# Altium schematic sheet BackplaneConnector.SchDoc: =ProjectName
size 420 x 297 mm; Author: G.K.; CompanyName: WUT; DrawnBy: G.K. and P.K.; Organization: WUT ISE; Address1: Warsaw Univeristy of Technology; Address2: Nowowiejska 15/19; DocumentNumber: 7; Revision: 1.1; SheetNumber: 7; SheetTotal: 12; EDA_Number: ARTIQ; Projet: ARTIQ/SINARA; ModifiedBy: -; CreateDate: XX/XX/XXXX; CheckedDate: -; Title2: BackplaneConnector.SchDoc; DivGrp: ISE; Designer: G.K.; ModifiedDate: -; ProjectName: ARTIQ/SINARA
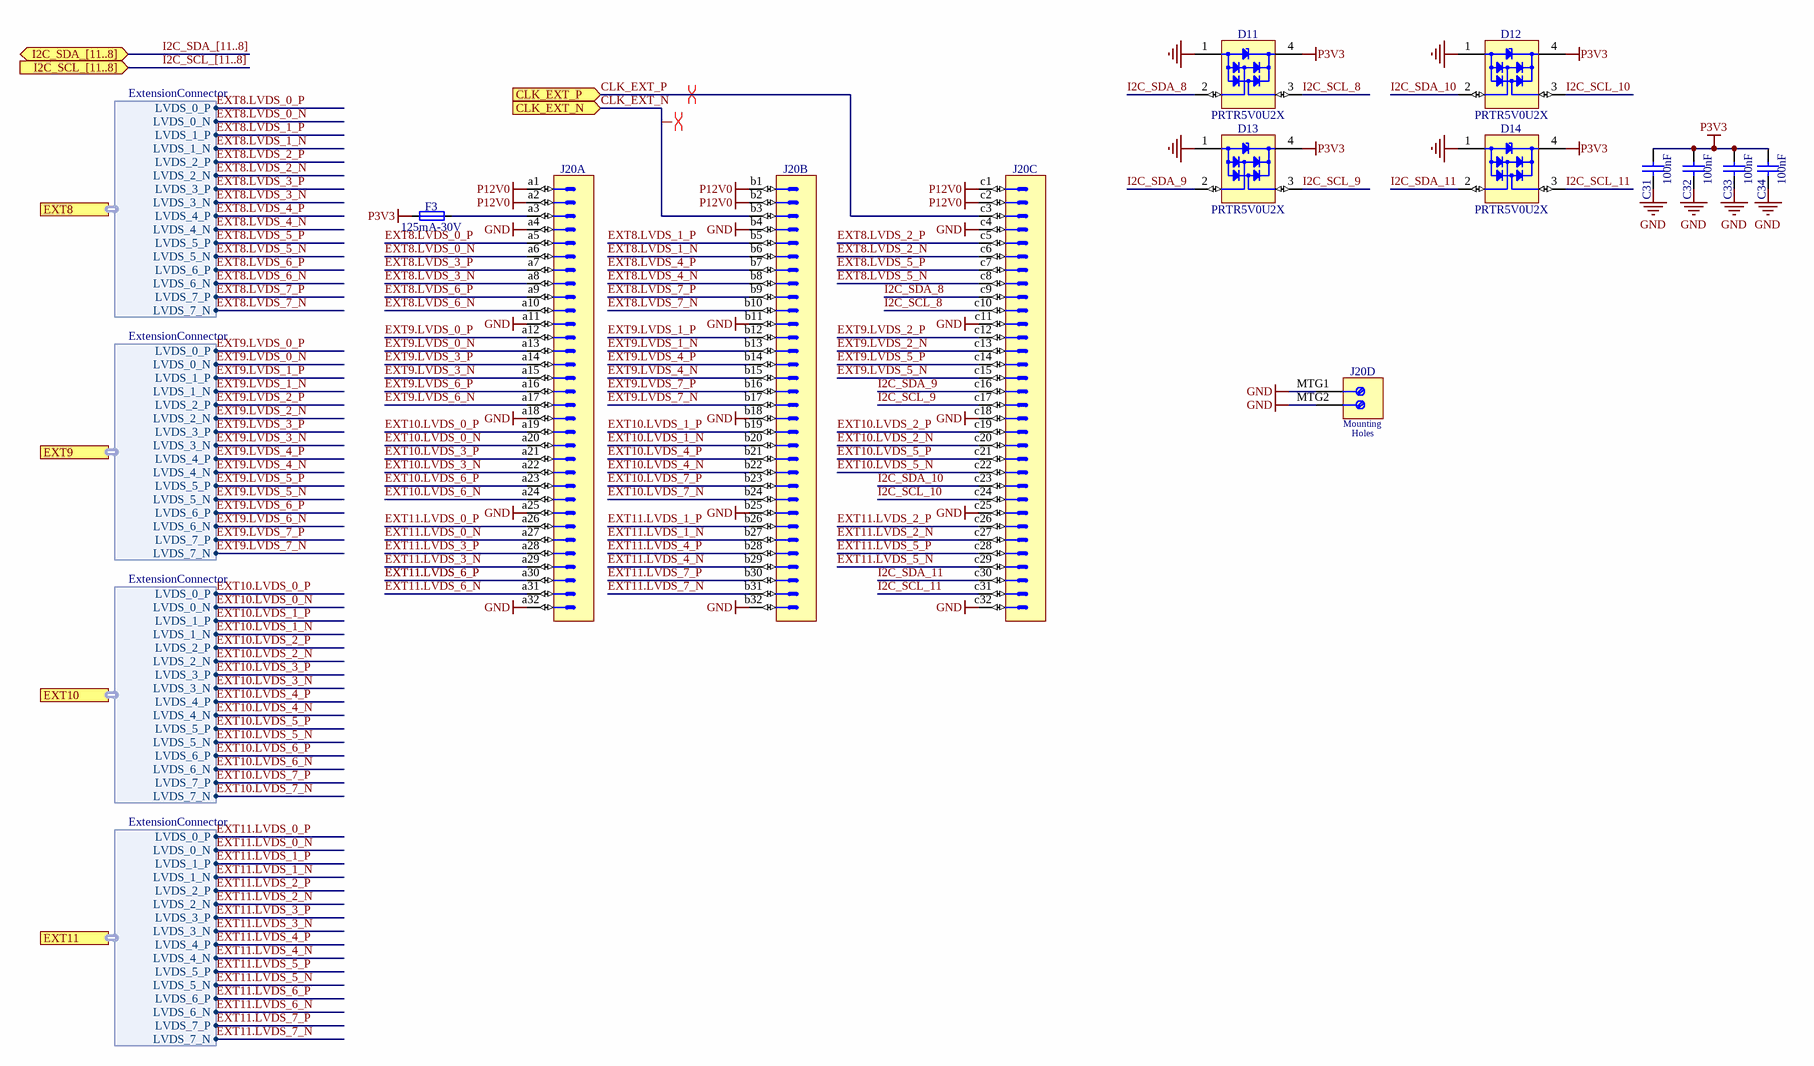
[diagram p0: BackplaneConnector.SchDoc]

## Parts
C31  100nF  [CAPC0603X33N]
C32  100nF  [CAPC0603X33N]
C33  100nF  [CAPC0603X33N]
C34  100nF  [CAPC0603X33N]
D11  PRTR5V0U2X  [SOT190P230X110-4N]
D12  PRTR5V0U2X  [SOT190P230X110-4N]
D13  PRTR5V0U2X  [SOT190P230X110-4N]
D14  PRTR5V0U2X  [SOT190P230X110-4N]
F3  125mA-30V  [FUSR_LITTELFUSE_1206L012]
J20  DIN 41612 Type C  [HARTING_09 03 196 2921]  (value not drawn)  (parts A,B,C,D of 4)

## Ports
CLK_EXT_N (in), CLK_EXT_P (in), EXT8 (harness ExtensionConnector), EXT9 (harness ExtensionConnector), EXT10 (harness ExtensionConnector), EXT11 (harness ExtensionConnector), I2C_SCL_[11..8] (in), I2C_SDA_[11..8] (bidir)

## Harnesses
ExtensionConnector: LVDS_0_N, LVDS_0_P, LVDS_1_N, LVDS_1_P, LVDS_2_N, LVDS_2_P, LVDS_3_N, LVDS_3_P, LVDS_4_N, LVDS_4_P, LVDS_5_N, LVDS_5_P, LVDS_6_N, LVDS_6_P, LVDS_7_N, LVDS_7_P

## Nets
GND: C31.1 C32.1 C33.1 C34.1 D11.1(GND) D12.1(GND) D13.1(GND) D14.1(GND) J20.a4 J20.a11 J20.a18 J20.a25 J20.a32 J20.b4 J20.b11 J20.b18 J20.b25 J20.b32 J20.c4 J20.c11 J20.c18 J20.c25 J20.c32 J20.MTG1 J20.MTG2
P3V3: C31.2 C32.2 C33.2 C34.2 D11.4(VCC) D12.4(VCC) D13.4(VCC) D14.4(VCC) F3.1
P12V0: J20.a1 J20.a2 J20.b1 J20.b2 J20.c1 J20.c2
CLK_EXT_N: J20.b3 ; port CLK_EXT_N
CLK_EXT_P: J20.c3 ; port CLK_EXT_P
EXT8.LVDS_0_N: J20.a6 ; port EXT8.LVDS_0_N
EXT8.LVDS_0_P: J20.a5 ; port EXT8.LVDS_0_P
EXT8.LVDS_1_N: J20.b6 ; port EXT8.LVDS_1_N
EXT8.LVDS_1_P: J20.b5 ; port EXT8.LVDS_1_P
EXT8.LVDS_2_N: J20.c6 ; port EXT8.LVDS_2_N
EXT8.LVDS_2_P: J20.c5 ; port EXT8.LVDS_2_P
EXT8.LVDS_3_N: J20.a8 ; port EXT8.LVDS_3_N
EXT8.LVDS_3_P: J20.a7 ; port EXT8.LVDS_3_P
EXT8.LVDS_4_N: J20.b8 ; port EXT8.LVDS_4_N
EXT8.LVDS_4_P: J20.b7 ; port EXT8.LVDS_4_P
EXT8.LVDS_5_N: J20.c8 ; port EXT8.LVDS_5_N
EXT8.LVDS_5_P: J20.c7 ; port EXT8.LVDS_5_P
EXT8.LVDS_6_N: J20.a10 ; port EXT8.LVDS_6_N
EXT8.LVDS_6_P: J20.a9 ; port EXT8.LVDS_6_P
EXT8.LVDS_7_N: J20.b10 ; port EXT8.LVDS_7_N
EXT8.LVDS_7_P: J20.b9 ; port EXT8.LVDS_7_P
EXT9.LVDS_0_N: J20.a13 ; port EXT9.LVDS_0_N
EXT9.LVDS_0_P: J20.a12 ; port EXT9.LVDS_0_P
EXT9.LVDS_1_N: J20.b13 ; port EXT9.LVDS_1_N
EXT9.LVDS_1_P: J20.b12 ; port EXT9.LVDS_1_P
EXT9.LVDS_2_N: J20.c13 ; port EXT9.LVDS_2_N
EXT9.LVDS_2_P: J20.c12 ; port EXT9.LVDS_2_P
EXT9.LVDS_3_N: J20.a15 ; port EXT9.LVDS_3_N
EXT9.LVDS_3_P: J20.a14 ; port EXT9.LVDS_3_P
EXT9.LVDS_4_N: J20.b15 ; port EXT9.LVDS_4_N
EXT9.LVDS_4_P: J20.b14 ; port EXT9.LVDS_4_P
EXT9.LVDS_5_N: J20.c15 ; port EXT9.LVDS_5_N
EXT9.LVDS_5_P: J20.c14 ; port EXT9.LVDS_5_P
EXT9.LVDS_6_N: J20.a17 ; port EXT9.LVDS_6_N
EXT9.LVDS_6_P: J20.a16 ; port EXT9.LVDS_6_P
EXT9.LVDS_7_N: J20.b17 ; port EXT9.LVDS_7_N
EXT9.LVDS_7_P: J20.b16 ; port EXT9.LVDS_7_P
EXT10.LVDS_0_N: J20.a20 ; port EXT10.LVDS_0_N
EXT10.LVDS_0_P: J20.a19 ; port EXT10.LVDS_0_P
EXT10.LVDS_1_N: J20.b20 ; port EXT10.LVDS_1_N
EXT10.LVDS_1_P: J20.b19 ; port EXT10.LVDS_1_P
EXT10.LVDS_2_N: J20.c20 ; port EXT10.LVDS_2_N
EXT10.LVDS_2_P: J20.c19 ; port EXT10.LVDS_2_P
EXT10.LVDS_3_N: J20.a22 ; port EXT10.LVDS_3_N
EXT10.LVDS_3_P: J20.a21 ; port EXT10.LVDS_3_P
EXT10.LVDS_4_N: J20.b22 ; port EXT10.LVDS_4_N
EXT10.LVDS_4_P: J20.b21 ; port EXT10.LVDS_4_P
EXT10.LVDS_5_N: J20.c22 ; port EXT10.LVDS_5_N
EXT10.LVDS_5_P: J20.c21 ; port EXT10.LVDS_5_P
EXT10.LVDS_6_N: J20.a24 ; port EXT10.LVDS_6_N
EXT10.LVDS_6_P: J20.a23 ; port EXT10.LVDS_6_P
EXT10.LVDS_7_N: J20.b24 ; port EXT10.LVDS_7_N
EXT10.LVDS_7_P: J20.b23 ; port EXT10.LVDS_7_P
EXT11.LVDS_0_N: J20.a27 ; port EXT11.LVDS_0_N
EXT11.LVDS_0_P: J20.a26 ; port EXT11.LVDS_0_P
EXT11.LVDS_1_N: J20.b27 ; port EXT11.LVDS_1_N
EXT11.LVDS_1_P: J20.b26 ; port EXT11.LVDS_1_P
EXT11.LVDS_2_N: J20.c27 ; port EXT11.LVDS_2_N
EXT11.LVDS_2_P: J20.c26 ; port EXT11.LVDS_2_P
EXT11.LVDS_3_N: J20.a29 ; port EXT11.LVDS_3_N
EXT11.LVDS_3_P: J20.a28 ; port EXT11.LVDS_3_P
EXT11.LVDS_4_N: J20.b29 ; port EXT11.LVDS_4_N
EXT11.LVDS_4_P: J20.b28 ; port EXT11.LVDS_4_P
EXT11.LVDS_5_N: J20.c29 ; port EXT11.LVDS_5_N
EXT11.LVDS_5_P: J20.c28 ; port EXT11.LVDS_5_P
EXT11.LVDS_6_N: J20.a31 ; port EXT11.LVDS_6_N
EXT11.LVDS_6_P: J20.a30 ; port EXT11.LVDS_6_P
EXT11.LVDS_7_N: J20.b31 ; port EXT11.LVDS_7_N
EXT11.LVDS_7_P: J20.b30 ; port EXT11.LVDS_7_P
I2C_SCL_8: D11.3(I/O2) J20.c10
I2C_SCL_9: D13.3(I/O2) J20.c17
I2C_SCL_10: D12.3(I/O2) J20.c24
I2C_SCL_11: D14.3(I/O2) J20.c31
I2C_SDA_8: D11.2(I/O1) J20.c9
I2C_SDA_9: D13.2(I/O1) J20.c16
I2C_SDA_10: D12.2(I/O1) J20.c23
I2C_SDA_11: D14.2(I/O1) J20.c30
NetF3_2: F3.2 J20.a3

## Buses and harness runs
bus I2C_SCL_[11..8] = port I2C_SCL_[11..8]
bus I2C_SDA_[11..8] = port I2C_SDA_[11..8]

## Layout directives
differential pair: CLK_EXT_N, CLK_EXT_P

## Notes on the sheet
- Project/Equipment
- Document
- Designer
- Drawn by
- Check.by
- File
- Last Mod.
- Print Date
- Sheet
- Size
- A3
- of
- Rev
- (in symbol HARTING_09 03 196 2921, part D) Mounting; Holes

## Library data of the parts
C31-C34 = CC0201_100NF_6.3V_10%_X5R: Non-polarised capacitor; Part Description: SMD Multilayer Chip Ceramic Capacitor; Manufacturer: GENERIC; Manufacturer1 Part Number: 02016D104KAT2A; Voltage: 6.3V; TC: X5R; Tolerance: ±10%; Part Number: CC0201_100NF_6.3V_10%_X5R; Component Kind: Standard; Component Type: Standard; Pin Count: 2; Value: 100nF; Status: Not Recommended; Manufacturer Part Number: CC0201_100NF_6.3V_10%_X5R; Case: 0201; Mounted: Yes; Socket: No; SMD: Yes; Sense: No; Manufacturer1 Example: AVX; Manufacturer1 ComponentHeight: 0.33mm; HelpURL: \\cern.ch\dfs\Applications\Altium\Datasheets\CC0201_X5R_AVX.pdf; Author: CERN DEM JLC; CreateDate: 2007-12-03; LatestRevisionDate: 2007-12-03
D11-D14 = PRTR5V0U2X: Ultra Low Capacitance Double Rail-to-Rail ESD Protection Diode; Part Description: Ultra Low Capacitance (1pF) Double Rail-to-Rail ESD Protection Diode (8kV); Manufacturer: NXP SEMICONDUCTORS; Voltage: 5.5V; PressFit: No; Bonding: No; Part Number: PRTR5V0U2X; Component Kind: Standard; Component Type: Standard; Device: PRTR5V0U2X; PackageDescription: SOT143B, SOT, 1.90mm Pitch; 4 Pin, 1.30mm W X 2.90mm L X 1.10mm H body, IPC Medium Density; Manufacturer Part Number: PRTR5V0U2X; Pin Count: 4; Case: SOT143B; Mounted: Yes; Socket: No; SMD: Yes; Sense: No; ComponentHeight: 1.1mm; HelpURL: \\cern.ch\dfs\Applications\Altium\Datasheets\PRTR5V0U2X.pdf; Author: CERN DEM JLC; CreateDate: 22.03.2011; LatestRevisionDate: 22.03.2011
F3 = FUSR_LITTELFUSE_1206L012: Fuse; Part Description: POLYFUSE® Surface Mount Resettable PTC; Manufacturer Part Number: 1206L012WR; PressFit: No; Part Number: FUSR_LITTELFUSE_1206L012; Component Kind: Standard; Component Type: Standard; Pin Count: 2; PackageDescription: Surface Mount POLY-FUSE® Resettable PTC, 1206L Series; Family: Fuses Resettable; Mounted: Yes; Socket: No; SMD: Yes; Sense: No; Value: 125mA-30V; Manufacturer: LITTELFUSE; ComponentHeight: 1.45mm; HelpURL: \\cern.ch\dfs\Applications\Altium\Datasheets\FUSR_LITTELFUSE_1206L012.pdf; Author: CERN DEM JLC; CreateDate: 19.12.2011; LatestRevisionDate: 19.12.2011
J20 = HARTING_09 03 196 2921: Connector 96abc male (3x32); Part Description: DIN 41612, Type C, 96 Position, Rows a+b+c, Performance level 1, Right Angle Male Connector, Lead 3.0 mm, Pitch 2.54mm; PressFit: No; Part Number: HARTING_09 03 196 2921; Component Kind: Standard; Component Type: Standard; Pin Count: 98; Family: DIN 41612 Type C; Mounted: Yes; Socket: No; SMD: No; Sense: No; Status: None; Manufacturer: HARTING; Manufacturer Part Number: 09 03 196 2921; ComponentHeight: 11mm; HelpURL: \\cern.ch\dfs\Applications\Altium\Datasheets\HARTING_09 03 196 2921.pdf; Author: CERN DEM JLC; CreateDate: 16.04.2008; LatestRevisionDate: 25.02.2013; ClassName: Connectors